# EAGLE design ATMEGA328_SUBSYSTEM (EAGLE 7.7.0)
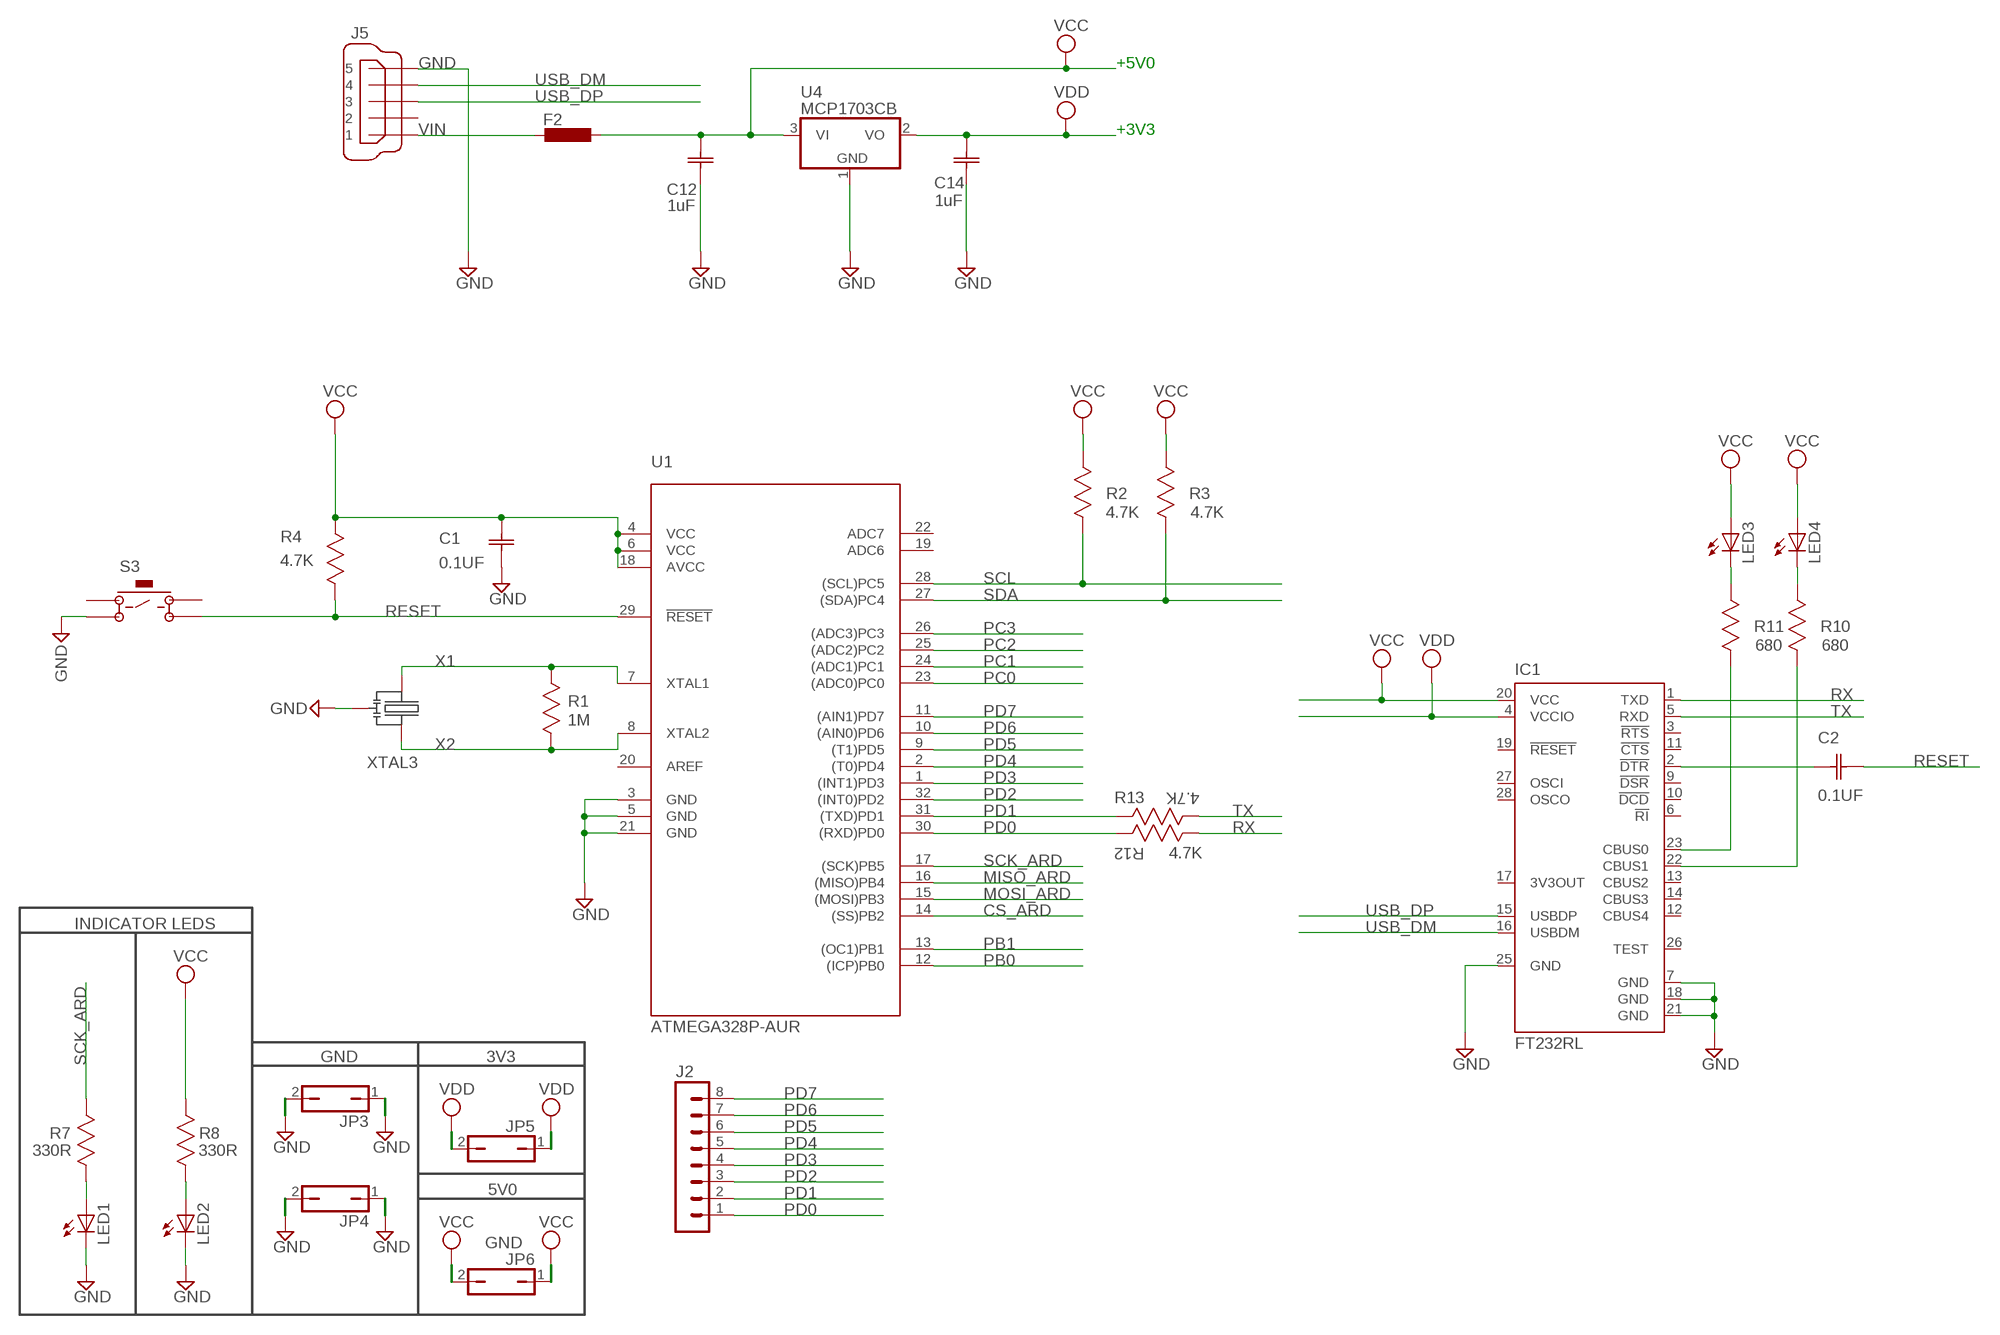
[diagram p0: schematic, sheet 1]

## Parts
C1  0.1UF  0603ZC104KA72A  [CAPC1608X90N]
C2  0.1UF  0603ZC104KA72A  [CAPC1608X90N]
C12  1uF  C0805C105K3RACTU  [CAPC2013X140N]
C14  1uF  C0805C105K3RACTU  [CAPC2013X140N]
F2  L-EUL1812  [L1812]
IC1  FT232RL  [SSOP28]
J2  MA08-1  [MA08-1]
J5  MINI-USB-UX60A-MB-5ST  [UX60A-MB-5ST]
JP3  JP1Q  [JP1]
JP4  JP1Q  [JP1]
JP5  JP1Q  [JP1]
JP6  JP1Q  [JP1]
LED1  LEDCHIP-LED0603  [CHIP-LED0603]
LED2  LEDCHIP-LED0603  [CHIP-LED0603]
LED3  LEDCHIPLED_0805  [CHIPLED_0805]
LED4  LEDCHIPLED_0805  [CHIPLED_0805]
R1  1M  MC0.063W06031%1M  [RESC1608X60N]
R2  4.7K  MC0.063W06031%4K7  [RESC1608X60N]
R3  4.7K  MC0.063W06031%4K7  [RESC1608X60N]
R4  4.7K  MC0.063W06031%4K7  [RESC1608X60N]
R7  330R  MC0.063W06031%330R  [RESC1608X60N]
R8  330R  MC0.063W06031%330R  [RESC1608X60N]
R10  680  MC0.063W06031%4K7  [RESC1608X60N]
R11  680  MC0.063W06031%4K7  [RESC1608X60N]
R12  4.7K  MC0.063W06031%4K7  [RESC1608X60N]
R13  4.7K  MC0.063W06031%4K7  [RESC1608X60N]
S3  1825910-6-SPST-NOPB-4P  [SW-NOPB-4]
U1  ATMEGA328P-AUR  [TQFP-32]
U4  MCP1703CB  [SOT23]
XTAL3  CSTCE16M0V53-R0  [CSTCE16M0V53-R0]

## Nets
GND: C1.1(C1) C12.1(C1) C14.1(C1) IC1.7(GND) IC1.18(GND) IC1.21(GND) IC1.25(GND) J5.5 JP3.1 JP3.2 JP4.1 JP4.2 LED1.C LED2.C S3.2 U1.3(GND) U1.5(GND) U1.21(GND) U4.1(GND) XTAL3.2
MISO_ARD: U1.16((MISO)PB4)
MOSI_ARD: U1.15((MOSI)PB3)
N$1: IC1.23(CBUS0) R11.2(R2)
N$4: C2.2(C2) IC1.2(!DTR)
N$5: IC1.22(CBUS1) R10.2(R2)
N$7: LED3.C R11.1(R1)
N$10: LED4.C R10.1(R1)
N$21: LED2.A R8.2(R2)
N$22: LED1.A R7.2(R2)
PB0: U1.12((ICP)PB0)
PB1: U1.13((OC1)PB1)
PC0: U1.23((ADC0)PC0)
PC1: U1.24((ADC1)PC1)
PC2: U1.25((ADC2)PC2)
PC3: U1.26((ADC3)PC3)
PD0: J2.1 R12.1(R1) U1.30((RXD)PD0)
PD1: J2.2 R13.1(R1) U1.31((TXD)PD1)
PD2: J2.3 U1.32((INT0)PD2)
PD3: J2.4 U1.1((INT1)PD3)
PD4: J2.5 U1.2((T0)PD4)
PD5: J2.6 U1.9((T1)PD5)
PD6: J2.7 U1.10((AIN0)PD6)
PD7: J2.8 U1.11((AIN1)PD7)
RESET: C2.1(C1) R4.2(R2) S3.4 U1.29(!RESET)
RX: IC1.1(TXD) R12.2(R2)
SCK_ARD: R7.1(R1) U1.17((SCK)PB5)
SCL: R2.2(R2) U1.28((SCL)PC5)
SDA: R3.2(R2) U1.27((SDA)PC4)
TX: IC1.5(RXD) R13.2(R2)
USB_DM: IC1.16(USBDM) J5.4
USB_DP: IC1.15(USBDP) J5.3
VCC: C1.2(C2) C12.2(C2) F2.1 IC1.20(VCC) JP6.1 JP6.2 LED3.A LED4.A R2.1(R1) R3.1(R1) R4.1(R1) R8.1(R1) U1.4(VCC) U1.6(VCC) U1.18(AVCC) U4.3(VI)
VDD: C14.2(C2) IC1.4(VCCIO) JP5.1 JP5.2 U4.2(VO)
VIN: F2.2 J5.1
X1: R1.2(R2) U1.7(XTAL1) XTAL3.1
X2: R1.1(R1) U1.8(XTAL2) XTAL3.3
Unconnected: IC1.3(!RTS) IC1.6(!RI) IC1.9(!DSR) IC1.10(!DCD) IC1.11(!CTS) IC1.12(CBUS4) IC1.13(CBUS2) IC1.14(CBUS3) IC1.17(3V3OUT) IC1.19(!RESET) IC1.26(TEST) IC1.27(OSCI) IC1.28(OSCO) J5.2 S3.1 S3.3 U1.14((SS)PB2) U1.19(ADC6) U1.20(AREF) U1.22(ADC7)

## Notes on the sheet
- +5V0
- +3V3
- INDICATOR LEDS
- GND | 3V3
- 5V0
- GND

## Library data of the parts
C1 C2 = AVX:0603ZC104KA72A: Capacitor, 0603; MPN: 0603ZC104KA72A; OC_FARNELL: -; OC_NEWARK: 55J2765; SUPPLIER: AVX; TOLERANCE: ±10%; VOLTAGERATING: 10V
C12 C14 = Kemet_By_element14_Batch_1:C0805C105K3RACTU: CAPACITOR, 0805; MPN: C0805C105K3RACTU; OC_FARNELL: 1637035; OC_NEWARK: 93K6001; SUPPLIER: Kemet; TOLERANCE: ±10%; VOLTAGERATING: 25V
F2 = rcl:L-EU: INDUCTOR, European symbol
IC1 = ftdichip:FT232R: Source: http://www.ftdichip.com/Documents/DataSheets/DS_FT232R_v104.pdf; MPN: FT232RL; OC_FARNELL: 1146032; OC_NEWARK: 91K9918
J2 = con-lstb:MA08-1: PIN HEADER; OC_FARNELL: unknown; OC_NEWARK: unknown
J5 = con-hirose:MINI-USB-: MINI USB Connector Source: http://www.hirose.co.jp/cataloge_hp/e24000019.pdf; OC_FARNELL: unknown; OC_NEWARK: unknown
JP3-JP6 = jumper:JP1Q: JUMPER
LED1 LED2 = led:LED: LED
LED3 LED4 = adafruit:LED: LED
R1 = Multicomp:MC0.063W06031%1M: RESISTOR, 0603; MPN: MC0.063W06031%1M; OC_FARNELL: 9330410; OC_NEWARK: 38K9946; SUPPLIER: Multicomp; TOLERANCE: 1%; VALUE: 1M Ohms; WATTAGE: 1/16 W
R2-R4 R10-R13 = Multicomp:MC0.063W06031%4K7: RESISTOR, 0603; MPN: MC0.063W06031%4K7; OC_FARNELL: 9331247; OC_NEWARK: -; SUPPLIER: Multicomp; TOLERANCE: 1%; VALUE: 4.7K Ohms; WATTAGE: 1/16 W
R7 R8 = Multicomp:MC0.063W06031%330R: RESISTOR, 0603; MPN: MC0.063W06031%330R; OC_FARNELL: 9331018; OC_NEWARK: -; SUPPLIER: Multicomp; TOLERANCE: ±1%; VALUE: 330 Ohms; WATTAGE: 1/16 W
S3 = 1825910-6:1825910-6-SPST-NOPB-4P
U1 = ATMEGA328P-AUR:ATMEGA328P-AUR: TQFP - High Performance, Low Power Atmel®AVR® 8-Bit Microcontroller Family; MANUFACTURER: ATMEL; PARTNO: ATMEGA328P-AUR
U4 = linear:MCP1703: 250 mA, 16V, Low Quiescent Current LDO Regulator Source: http://ww1.microchip.com/downloads/en/DeviceDoc/22049b.pdf
XTAL3 = CSTCE16M0V53-R0:CSTCE16M0V53-R0

## Board
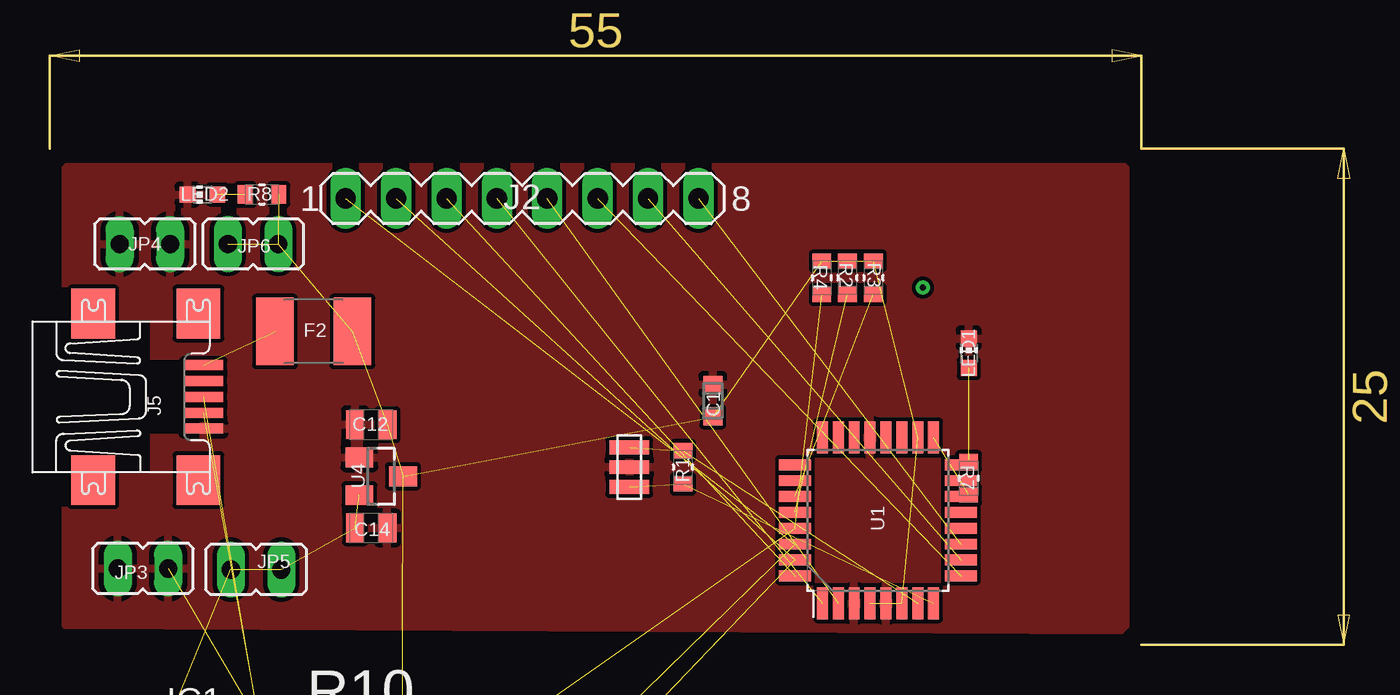
[diagram p1: board, top side]
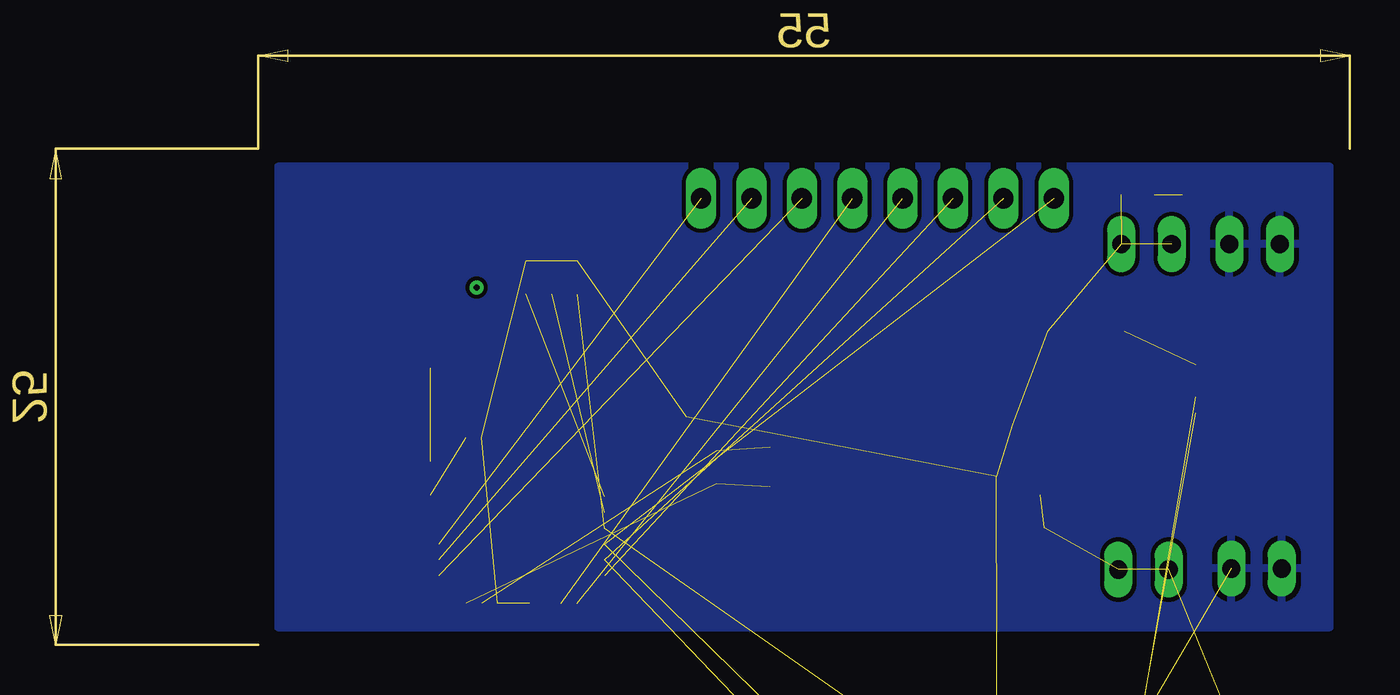
[diagram p2: board, bottom side, seen from below]

Size 65.5 x 30 mm. Coordinates in mm from the lower left corner, seen from the top.
Copper layers (1*16): Top 0.035mm / dielectric 1.5mm / Bottom 0.035mm
Design rules "default *": minimum track width 10mil, minimum drill 12mil, track to track 8mil, track to pad 5mil, pad to pad 5mil, via to via 8mil, smd to smd 5mil, copper to edge 40mil, drill to drill 8mil, minimum pad ring 10mil, minimum via ring 8mil, stop-mask expansion 4mil, vias tented up to drill 0mil, thermal gap 10mil

### Footprints (pad centres in the part's own frame; a part is rotated, then mirrored left to right if it is on the bottom)
CAPC1608X90N = smd 0.864 x 0.965: 1 -0.813,0; 2 0.813,0
CAPC2013X140N = smd 0.914 x 1.448: 1 -0.813,0; 2 0.813,0
L1812 = smd 1.9 x 3.4: 1 -1.95,0; 2 1.95,0
SSOP28 = smd 0.4 x 1.5: 1 -4.225,-3.625; 2 -3.575,-3.625; 3 -2.925,-3.625; 4 -2.275,-3.625; 5 -1.625,-3.625; 6 -0.975,-3.625; 7 -0.325,-3.625; 8 0.325,-3.625; 9 0.975,-3.625; 10 1.625,-3.625; 11 2.275,-3.625; 12 2.925,-3.625; 13 3.575,-3.625; 14 4.225,-3.625; 15 4.225,3.625; 16 3.575,3.625; 17 2.925,3.625; 18 2.275,3.625; 19 1.625,3.625; 20 0.975,3.625; 21 0.325,3.625; 22 -0.325,3.625; 23 -0.975,3.625; 24 -1.625,3.625; 25 -2.275,3.625; 26 -2.925,3.625; 27 -3.575,3.625; 28 -4.225,3.625
MA08-1 = drill 1.016 long: 1 -8.89,0; 2 -6.35,0; 3 -3.81,0; 4 -1.27,0; 5 1.27,0; 6 3.81,0; 7 6.35,0; 8 8.89,0
UX60A-MB-5ST = smd 2 x 0.5: 1 2.25,1.6; 2 2.25,0.8; 3 2.25,0; 4 2.25,-0.8; 5 2.25,-1.6 | smd 2.2 x 2.5: M1 -3.3,-4.2; M2 -3.3,4.2; M3 2,4.2; M4 2,-4.2
JP1 = drill 0.914 long: 1 0,-1.27; 2 0,1.27
CHIP-LED0603 = smd 0.8 x 0.8: A 0,-0.75; C 0,0.75
CHIPLED_0805 = smd 1.2 x 1.2: A 0,-1.05; C 0,1.05
RESC1608X60N = smd 0.762 x 0.94: 1 -0.838,0; 2 0.838,0
SW-NOPB-4 = drill 0.8 pad 1.1 long: 1 0,4.5; 2 6.5,4.5; 3 0,0; 4 6.5,0
TQFP-32 = smd 0.55 x 1.6: 1 -2.8,-4.18; 2 -2,-4.18; 3 -1.2,-4.18; 4 -0.4,-4.18; 5 0.4,-4.18; 6 1.2,-4.18; 7 2,-4.18; 8 2.8,-4.18; 17 2.8,4.18; 18 2,4.18; 19 1.2,4.18; 20 0.4,4.18; 21 -0.4,4.18; 22 -1.2,4.18; 23 -2,4.18; 24 -2.8,4.18 | smd 1.6 x 0.55: 9 4.18,-2.8; 10 4.18,-2; 11 4.18,-1.2; 12 4.18,-0.4; 13 4.18,0.4; 14 4.18,1.2; 15 4.18,2; 16 4.18,2.8; 25 -4.18,2.8; 26 -4.18,2; 27 -4.18,1.2; 28 -4.18,0.4; 29 -4.18,-0.4; 30 -4.18,-1.2; 31 -4.18,-2; 32 -4.18,-2.8
SOT23 = smd 1 x 1.4: 1 -0.95,-1.1; 2 0.95,-1.1; 3 0,1.1
CSTCE16M0V53-R0 = smd 0.7 x 2: 1 -1,0; 2 0,0; 3 1,0

### Placement (x,y rotation side)
C1  33.41,12.31 270 top
C2  -0.4,-17.8 270 top  (outside the outline)
C12  16.2,11.1 0 top
C14  16.2,5.9 180 top
F2  13.3,15.8 180 top
IC1  8.5,-8.9 270 top  (outside the outline)
J2  23.8,22.5 0 top
J5  5.5,12.5 0 top
JP3  4.7,3.85 270 top
JP4  4.8,20.2 270 top
JP5  10.4,3.8 270 top
JP6  10.25,20.2 270 top
LED1  46.3,14.7 0 top
LED2  7.7,22.7 90 top
LED3  16.7,-9 90 top  (outside the outline)
LED4  16.7,-12.2 90 top  (outside the outline)
R1  31.91,8.95 90 top
R2  40.19,18.51 270 top
R3  41.5,18.51 270 top
R4  38.9,18.5 270 top
R7  46.3,8.4 90 top
R8  10.7,22.7 180 top
R10  16.4,-4.6 0 top  (outside the outline)
R11  16.2,-6.5 0 top  (outside the outline)
R12  16.7,-16.1 0 top  (outside the outline)
R13  16.7,-18.4 0 top  (outside the outline)
S3  11.4,-17 180 top  (outside the outline)
U1  41.73,6.28 0 top
U4  16.7,8.5 270 top
XTAL3  29.2,8.96 270 top

### Tracks (layer width: path | path; a pad name or v marks a point on that pad's centre or on a via)
GND  (5 unrouted)
  pour Bottom: 1,24.1 53.9,24.1 54,24.1 54,0.9 1,0.9
  pour Top: 0.9,1 0.8,1 0.8,24.1 54.2,24.1 54.2,0.7
N$1  (1 unrouted)
N$3  (via drill 0.3)
  other vias: 44,18
N$4  (1 unrouted)
N$5  (1 unrouted)
N$7  (1 unrouted)
N$10  (1 unrouted)
N$21  (1 unrouted)
N$22  (1 unrouted)
PD0  (2 unrouted)
PD1  (2 unrouted)
PD2  (1 unrouted)
PD3  (1 unrouted)
PD4  (1 unrouted)
PD5  (1 unrouted)
PD6  (1 unrouted)
PD7  (1 unrouted)
RESET  (3 unrouted)
RX  (1 unrouted)
SCK_ARD  (1 unrouted)
SCL  (1 unrouted)
SDA  (1 unrouted)
TX  (1 unrouted)
USB_DM  (1 unrouted)
USB_DP  (1 unrouted)
VCC  (15 unrouted)
VDD  (4 unrouted)
VIN  (1 unrouted)
X1  (2 unrouted)
X2  (2 unrouted)

### Text on the board
_tNames: PWR LED